# EAGLE schematic LTC4222 (EAGLE 9.6.2)
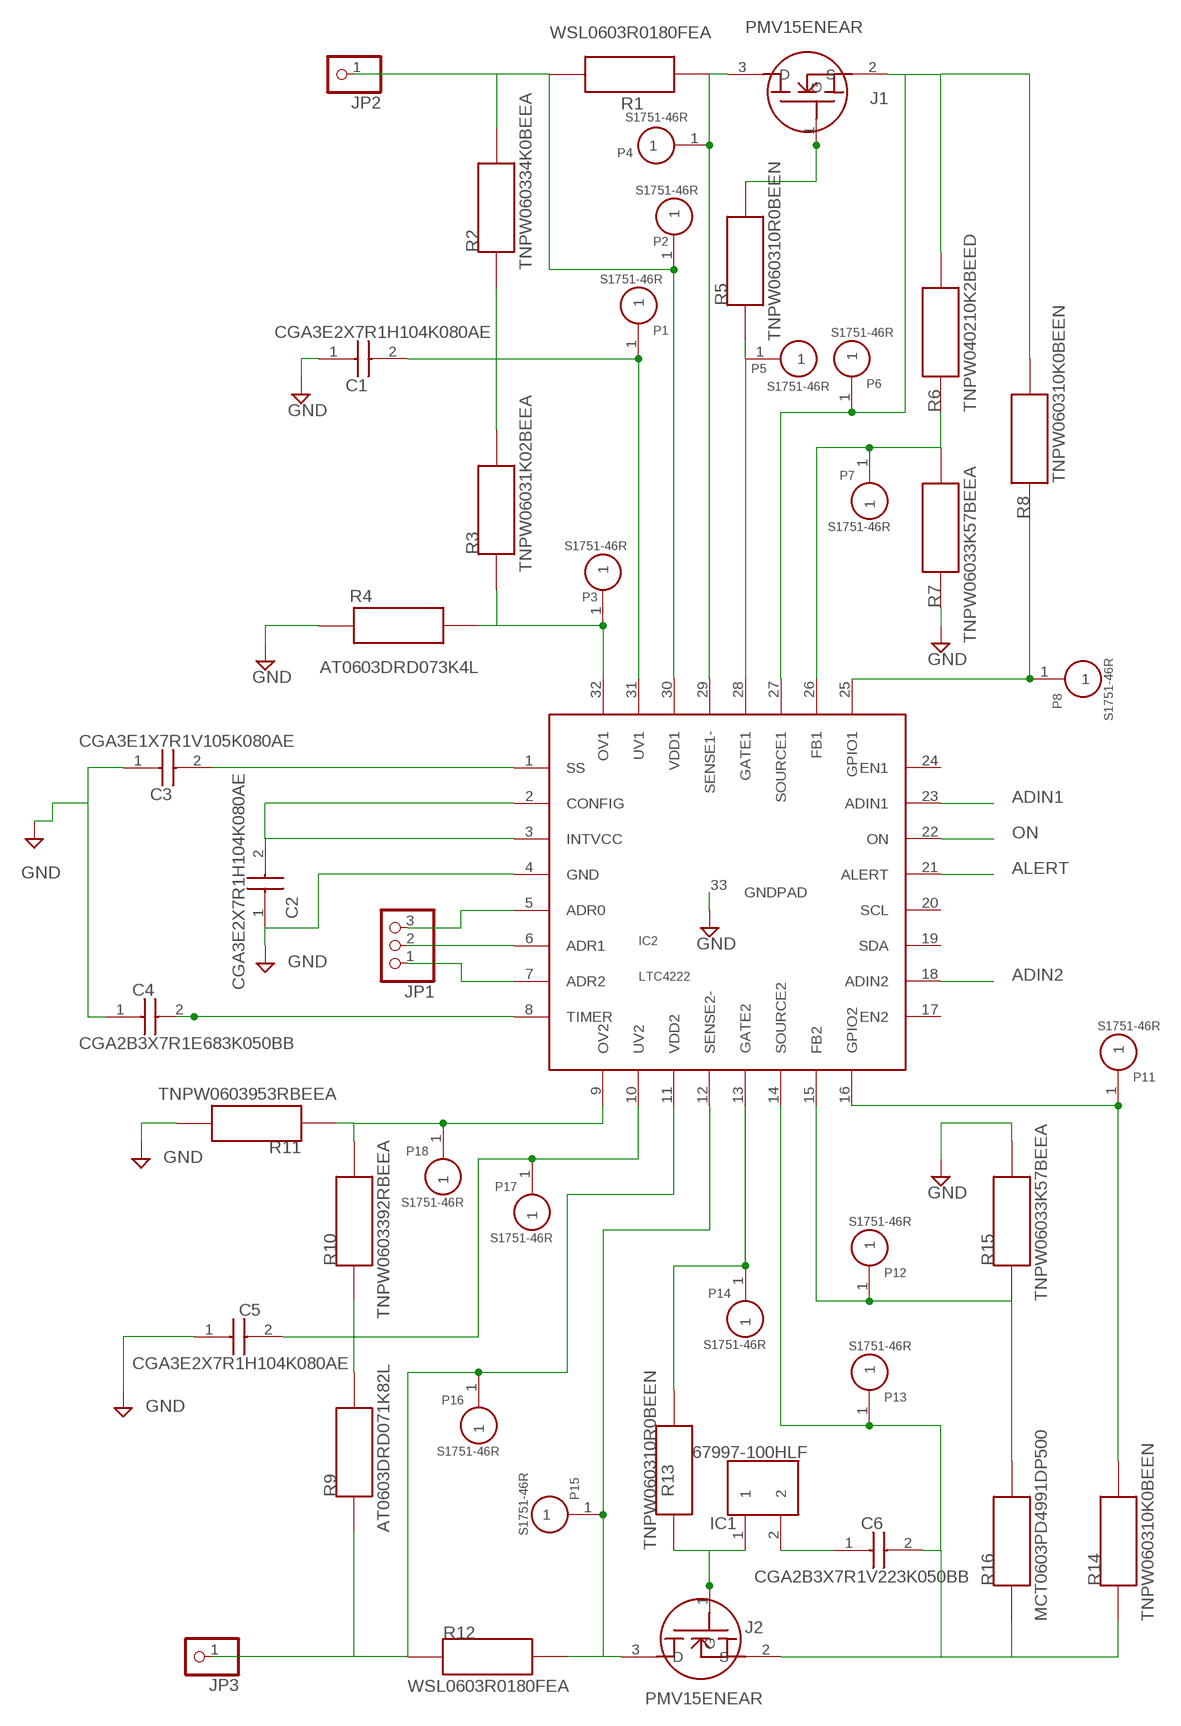
[diagram p0: schematic, sheet 1]

## Parts
C1  CGA3E2X7R1H104K080AE  [CAPC1608X80M]
C2  CGA3E2X7R1H104K080AE  [CAPC1608X80M]
C3  CGA3E1X7R1V105K080AE  [CAPC1608X80M]
C4  CGA2B3X7R1E683K050BB  [CAPC1005X50M]
C5  CGA3E2X7R1H104K080AE  [CAPC1608X80M]
C6  CGA2B3X7R1V223K050BB  [CAPC1005X50M]
IC1  67997-100HLF  [HDRV2W64P254_2X1_241X508X838B]
IC2  LTC4222  [QFN50P500X500X75-33T345M]
J1  PMV15ENEAR  [SOT95P230X110-3M]
J2  PMV15ENEAR  [SOT95P230X110-3M]
JP1  PINHD-1X3  [1X03]
JP2  PINHD-1X1  [1X01]
JP3  PINHD-1X1  [1X01]
P1  S1751-46R  [S1751-46R]
P2  S1751-46R  [S1751-46R]
P3  S1751-46R  [S1751-46R]
P4  S1751-46R  [S1751-46R]
P5  S1751-46R  [S1751-46R]
P6  S1751-46R  [S1751-46R]
P7  S1751-46R  [S1751-46R]
P8  S1751-46R  [S1751-46R]
P11  S1751-46R  [S1751-46R]
P12  S1751-46R  [S1751-46R]
P13  S1751-46R  [S1751-46R]
P14  S1751-46R  [S1751-46R]
P15  S1751-46R  [S1751-46R]
P16  S1751-46R  [S1751-46R]
P17  S1751-46R  [S1751-46R]
P18  S1751-46R  [S1751-46R]
R1  WSL0603R0180FEA  [RESC1507X40M]
R2  TNPW060334K0BEEA  [AT0603]
R3  TNPW06031K02BEEA  [AT0603]
R4  AT0603DRD073K4L  [RESC1608X45M]
R5  TNPW060310R0BEEN  [AT0603]
R6  TNPW040210K2BEED  [RESC1005X35M]
R7  TNPW06033K57BEEA  [AT0603]
R8  TNPW060310K0BEEN  [AT0603]
R9  AT0603DRD071K82L  [RESC1608X45M]
R10  TNPW0603392RBEEA  [AT0603]
R11  TNPW0603953RBEEA  [AT0603]
R12  WSL0603R0180FEA  [RESC1507X40M]
R13  TNPW060310R0BEEN  [AT0603]
R14  TNPW060310K0BEEN  [AT0603]
R15  TNPW06033K57BEEA  [AT0603]
R16  MCT0603PD4991DP500  [RESC1508X47M]

## Nets
ADIN1: IC2.23(ADIN1)
ADIN2: IC2.18(ADIN2)
ALERT: IC2.21(ALERT)
GND: C1.1 C2.1 C3.1 C4.1 C5.1 IC2.4(GND) R4.2 R7.1 R11.2 R15.2
N$1: J1.1(G) R5.2
N$2: IC2.30(VDD1) JP2.1 P2.1 R1.1 R2.2
N$6: IC2.29(SENSE1-) J1.3(D) P4.1 R1.2
N$7: IC2.32(OV1) P3.1 R3.1 R4.1
N$8: C1.2 IC2.31(UV1) P1.1 R2.1 R3.2
N$10: C2.2 IC2.2(CONFIG) IC2.3(INTVCC)
N$11: IC2.28(GATE1) P5.1 R5.1
N$12: IC2.27(SOURCE1) J1.2(S) P6.1 R6.2 R8.2
N$13: IC2.7(ADR2) JP1.1
N$14: IC2.25(GPIO1) P8.1 R8.1
N$15: C4.2 IC2.8(TIMER)
N$16: C3.2 IC2.1(SS)
N$18: IC2.13(GATE2) P14.1 R13.2
N$19: IC2.9(OV2) P18.1 R10.2 R11.1
N$20: IC2.12(SENSE2-) J2.3(D) P15.1 R12.2
N$21: IC2.11(VDD2) JP3.1 P16.1 R9.1 R12.1
N$22: IC1.1 J2.1(G) R13.1
N$23: C6.2 IC2.14(SOURCE2) J2.2(S) P13.1 R14.1 R16.1
N$24: C6.1 IC1.2
N$25: IC2.15(FB2) P12.1 R15.1 R16.2
N$26: IC2.16(GPIO2) P11.1 R14.2
N$27: C5.2 IC2.10(UV2) P17.1 R9.2 R10.1
N$29: IC2.26(FB1) P7.1 R6.1 R7.2
N$30: IC2.6(ADR1) JP1.2
N$31: IC2.5(ADR0) JP1.3
ON: IC2.22(ON)
Unconnected: IC2.17(EN2) IC2.19(SDA) IC2.20(SCL) IC2.24(EN1) IC2.33(GNDPAD)

## Library data of the parts
C1 C2 C5 = Baja_Parts_Lib:CGA3E2X7R1H104K080AE: Multilayer Ceramic Capacitors MLCC - SMD/SMT SOFT 0603 50V 0.1uF X7R 10% AEC-Q200 Source: Data Sheet <https://product.tdk.com/system/files/dam/doc/product/capacitor/ceramic/mlcc/catalog/mlcc_automotive_soft_en.pdf>; DESCRIPTION: Multilayer Ceramic Capacitors MLCC - SMD/SMT SOFT 0603 50V 0.1uF X7R 10% AEC-Q200; HEIGHT: 0.8 mm; MANUFACTURER_NAME: TDK; MANUFACTURER_PART_NUMBER: CGA3E2X7R1H104K080AE; MOUSER_PART_NUMBER: 810-CGA3E2X7R1H104KE; MOUSER_PRICE-STOCK: https://www.mouser.com/ProductDetail/TDK/CGA3E2X7R1H104K080AE?qs=n%2FVzw7c4a0kvajqFvEbDzQ%3D%3D
C3 = Baja_Parts_Lib:CGA3E1X7R1V105K080AE: Multilayer Ceramic Capacitors MLCC - SMD/SMT SOFT 0603 35V 1uF X7R 10% AEC-Q200 Source: Data Sheet <https://product.tdk.com/system/files/dam/doc/product/capacitor/ceramic/mlcc/catalog/mlcc_automotive_soft_en.pdf>; DESCRIPTION: Multilayer Ceramic Capacitors MLCC - SMD/SMT SOFT 0603 35V 1uF X7R 10% AEC-Q200; HEIGHT: 0.8 mm; MANUFACTURER_NAME: TDK; MANUFACTURER_PART_NUMBER: CGA3E1X7R1V105K080AE; MOUSER_PART_NUMBER: 810-CGA3E1X7R1V105KA; MOUSER_PRICE-STOCK: https://www.mouser.com/ProductDetail/TDK/CGA3E1X7R1V105K080AE?qs=nQSIdc08i%252BfiPojSMYifNA%3D%3D
C4 = Baja_Parts_Lib:CGA2B3X7R1E683K050BB: Multilayer Ceramic Capacitors MLCC - SMD/SMT CGA 0402 25V 0.068uF X7R 10% AEC-Q200 Source: Data Sheet <https://product.tdk.com/system/files/dam/doc/product/capacitor/ceramic/mlcc/catalog/mlcc_automotive_general_en.pdf>; DESCRIPTION: Multilayer Ceramic Capacitors MLCC - SMD/SMT CGA 0402 25V 0.068uF X7R 10% AEC-Q200; HEIGHT: 0.5 mm; MANUFACTURER_NAME: TDK; MANUFACTURER_PART_NUMBER: CGA2B3X7R1E683K050BB; MOUSER_PART_NUMBER: 810-CGA2B3X7R1E683KB; MOUSER_PRICE-STOCK: https://www.mouser.com/ProductDetail/TDK/CGA2B3X7R1E683K050BB?qs=xLDY6iXSiQadJRj3xSTsHw%3D%3D
C6 = Baja_Parts_Lib:CGA2B3X7R1V223K050BB: Multilayer Ceramic Capacitors MLCC - SMD/SMT CGA 0402 35V 0.022uF X7R 10% AEC-Q200 Source: Data Sheet <https://product.tdk.com/system/files/dam/doc/product/capacitor/ceramic/mlcc/catalog/mlcc_automotive_general_en.pdf>; DESCRIPTION: Multilayer Ceramic Capacitors MLCC - SMD/SMT CGA 0402 35V 0.022uF X7R 10% AEC-Q200; HEIGHT: 0.5 mm; MANUFACTURER_NAME: TDK; MANUFACTURER_PART_NUMBER: CGA2B3X7R1V223K050BB; MOUSER_PART_NUMBER: 810-CGA2B3X7R1V223KB; MOUSER_PRICE-STOCK: https://www.mouser.com/ProductDetail/TDK/CGA2B3X7R1V223K050BB?qs=xLDY6iXSiQZvE13Mgd36Mg%3D%3D
IC1 = Baja_Parts_Lib:67997-100HLF: Headers & Wire Housings .100CC STR HEADER Source: Data Sheet <https://www.mouser.com/datasheet/2/18/1/bwb_bergstik-2578275.pdfhttps://www.mouser.com/datasheet/2/18/1/bwb_bergstik-2578275.pdf>; DESCRIPTION: Headers & Wire Housings .100CC STR HEADER; HEIGHT: 31.04 mm; MANUFACTURER_NAME: Amphenol FCi; MANUFACTURE_PART_NUMBER: 67997-100HLF; MOUSER_PART_NUMBER: 649-67997-100HLF; MOUSER_PRICE-STOCK: https://www.mouser.com/ProductDetail/Amphenol-FCI/67997-100HLF?qs=cpLrBgdhsoH33Mp6xh%2FbyQ%3D%3D
IC2 = Baja_Parts_Lib:LTC4222: Hot Swap Voltage Controllers Dual Hot Swap Controller w/ADC and I2C Source: Data Sheet <https://www.mouser.com/datasheet/2/609/4222fb-1270163.pdf>; DESCRIPTION: Hot Swap Voltage Controllers Dual Hot Swap Controller w/ADC and I2C; HEIGHT: 0.75 mm; MANUFACTURER_NAME: Analog Devices; MANUFACTURER_PART_NUMBER: LTC4222CUH#PBF; MOUSER_PART_NUMBER: 584-LTC4222CUH#PBF; MOUSER_PRICE-STOCK: https://www.mouser.com/ProductDetail/Analog-Devices/LTC4222CUHPBF?qs=sGAEpiMZZMsKEdP9slC0YZc6cH0Tuf0NcujsStLpH6A%3D
J1 J2 = Baja_Parts_Lib:PMV15ENEAR: MOSFET 30V N-CHANNEL Source: Data Sheet <https://www.mouser.com/datasheet/2/916/PMV15ENEA-1604828.pdf>; DESCRIPTION: MOSFET 30V N-CHANNEL; HEIGHT: 1 mm; MANUFACTURER_NAME: Nexperia; MANUFACTURER_PART_NUMBER: PMV15ENEAR; MOUSER_PART_NUMBER: 771-PMV15ENEAR; MOUSER_PRICE-STOCK: https://www.mouser.com/ProductDetail/Nexperia/PMV15ENEAR?qs=T3oQrply3y80fkWq77yzJw%3D%3D
JP1 = pinhead:PINHD-1X3: PIN HEADER
JP2 JP3 = pinhead:PINHD-1X1: PIN HEADER
P1-P8 P11-P18 = Baja_Parts_Lib:S1751-46R
R1 R12 = Baja_Parts_Lib:WSL0603R0180FEA: Current Sense Resistors - SMD 1/10watt .018ohms 1% Source: Data Sheet <https://www.mouser.com/datasheet/2/427/VISH_S_A0011931981_1-2572395.pdf>; DESCRIPTION: Current Sense Resistors - SMD 1/10watt .018ohms 1%; HEIGHT: 0.33 mm; MANUFACTURER_NAME: Vishay/Dale; MANUFACTURER_PART_NUMBER: WSL0603R0180FEA; MOUSER_PART_NUMBER: 71-WSL0603R0180FEA; MOUSER_PRICE-STOCK: https://www.mouser.com/ProductDetail/Vishay-Dale/WSL0603R0180FEA?qs=WgxguIJepIVxM5lrrv8PKQ%3D%3D
R2 = Baja_Parts_Lib:TNPW060334K0BEEA: Thin Film Resistors - SMD 34Kohms .1% 25ppm Source: Data Sheet <https://www.mouser.com/datasheet/2/427/tnpw_e3-1761965.pdf>; DESCRIPTION: Thin Film Resistors - SMD 34Kohms .1% 25ppm; HEIGHT: 0.45 mm; MANUFACTURER_NAME: Vishay/Dale; MANUFACTURER_PART_NUMBER: TNPW060334K0BEEA; MOUSER_PART_NUMBER: 71-TNPW060334K0BEEA; MOUSER_PRICE-STOCK: https://www.mouser.com/ProductDetail/Vishay-Dale/TNPW060334K0BEEA?qs=kHCK1FE53PlE3u8PggA5Ww%3D%3D
R3 = Baja_Parts_Lib:TNPW06031K02BEEA: Thin Film Resistors - SMD 1.02Kohms .1% 25ppm Source: Data Sheet <https://www.mouser.com/datasheet/2/427/tnpw_e3-1761965.pdf>; DESCRIPTION: Thin Film Resistors - SMD 1.02Kohms .1% 25ppm; HEIGHT: 0.45 mm; MANUFACTURER_NAME: Vishay/Dale; MANUFACTURER_PART_NUMBER: TNPW06031K02BEEA; MOUSER_PART_NUMBER: 71-TNPW06031K02BEEA; MOUSER_PRICE-STOCK: https://www.mouser.com/ProductDetail/Vishay-Dale/TNPW06031K02BEEA?qs=U8jWr0D8IJjr1FstIpZwmw%3D%3D
R4 = Baja_Parts_Lib:AT0603DRD073K4L: Thin Film Resistors - SMD 3.4 Kohms 0.5% Tol. AEC-Q200 Source: Data Sheet <https://www.mouser.com/datasheet/2/447/PYu_AT_51_RoHS_L_5-1714247.pdf>; DESCRIPTION: Thin Film Resistors - SMD 3.4 Kohms 0.5% Tol. AEC-Q200; HEIGHT: 0.45 mm; MANUFACTURER_PART_NUMBER: AT0603DRD073K4L; MANUFACTURE_NAME: YAGEO; MOUSER_PART_NUMBER: 603-AT0603DRD073K4L; MOUSER_PRICE-STOCK: https://www.mouser.com/ProductDetail/YAGEO/AT0603DRD073K4L?qs=tggtontpCXPtTFYMCVhXyg%3D%3D
R5 R13 = Baja_Parts_Lib:TNPW060310R0BEEN: Thin Film Resistors - SMD 10ohms .1% 25ppm Source: Data Sheet <https://www.mouser.com/datasheet/2/427/tnpw_e3-1761965.pdf>; DESCRIPTION: Thin Film Resistors - SMD 10ohms .1% 25ppm; HEIGHT: 0.45 mm; MANUFACTURER_NAME: Vishay/Dale; MANUFACTURER_PART_NUMBER: TNPW060310R0BEEN; MOUSER_PART_NUMBER: 71-TNPW060310R0BEEN; MOUSER_PRICE-STOCK: https://www.mouser.com/ProductDetail/Vishay-Dale/TNPW060310R0BEEN?qs=sGAEpiMZZMtlubZbdhIBINBUesVvBWI8Ir7KK%252BezhzA%3D
R6 = Baja_Parts_Lib:TNPW040210K2BEED: Thin Film Resistors - SMD 10.2Kohms .1% 25ppm Source: Data Sheet <https://www.mouser.com/datasheet/2/427/tnpw_e3-1761965.pdf>; DESCRIPTION: Thin Film Resistors - SMD 10.2Kohms .1% 25ppm; HEIGHT: 0.35 mm; MANUFACTURER_NAME: Vishay/Dale; MANUFACTURER_PART_NUMBER: TNPW040210K2BEED; MOUSER_PART_NUMBER: 71-TNPW040210K2BEED; MOUSER_PRICE-STOCK: https://www.mouser.com/ProductDetail/Vishay-Dale/TNPW040210K2BEED?qs=sGAEpiMZZMtlubZbdhIBIPq2G7T3A9VRhqKxiHUGEIk%3D
R7 R15 = Baja_Parts_Lib:TNPW06033K57BEEA: Thin Film Resistors - SMD 3.57kohms .1% 25ppm Source: Data Sheet <https://www.mouser.com/datasheet/2/427/tnpw_e3-1761965.pdf>; DESCRIPTION: Thin Film Resistors - SMD 3.57kohms .1% 25ppm; HEIGHT: 0.45 mm; MANUFACTURER_NAME: Vishay/Dale; MANUFACTURER_PART_NUMBER: TNPW06033K57BEEA; MOUSER_PART_NUMBER: 71-TNPW06033K57BEEA; MOUSER_PRICE-STOCK: https://www.mouser.com/ProductDetail/Vishay-Dale/TNPW06033K57BEEA?qs=kHCK1FE53Pku%252BV6IyV8rEg%3D%3D
R8 R14 = Baja_Parts_Lib:TNPW060310K0BEEN: Thin Film Resistors - SMD 10Kohms .1% 25ppm Source: Data Sheet <https://www.mouser.com/datasheet/2/427/tnpw_e3-1761965.pdf>; DESCRIPTION: Thin Film Resistors - SMD 10Kohms .1% 25ppm; HEIGHT: 0.45 mm; MANUFACTURER_NAME: Vishay/Dale; MANUFACTURER_PART_NUMBER: TNPW060310K0BEEN; MOUSER_PART_NUMBER: 71-TNPW060310K0BEEN; MOUSER_PRICE-STOCK: https://www.mouser.com/ProductDetail/Vishay-Dale/TNPW060310K0BEEN?qs=ys0FHdAnsy4pY5DJwuessg%3D%3D
R9 = Baja_Parts_Lib:AT0603DRD071K82L: Thin Film Resistors - SMD 1.82 Kohms 0.5% Tol. AEC-Q200 Source: Data Sheet <https://www.mouser.com/datasheet/2/447/PYu_AT_51_RoHS_L_5-1714247.pdf>; DESCRIPTION: Thin Film Resistors - SMD 1.82 Kohms 0.5% Tol. AEC-Q200; HEIGHT: 0.45 mm; MANUFACTURER_NAME: YAGEO; MANUFACTURER_PART_NUMBER: AT0603DRD071K82L; MOUSER_PART_NUMBER: 603-AT0603DRD071K82L; MOUSER_PRICE-STOCK: https://www.mouser.com/ProductDetail/Yageo/AT0603DRD071K82L?qs=tggtontpCXPbCWwxdLaIvQ%3D%3D
R10 = Baja_Parts_Lib:TNPW0603392RBEEA: Thin Film Resistors - SMD 392ohms .1% 25ppm Source: Data Sheet <https://www.mouser.com/datasheet/2/427/tnpw_e3-1761965.pdf>; DESCRIPTION: Thin Film Resistors - SMD 392ohms .1% 25ppm; HEIGHT: 0.45 mm; MANUFACTURER_NAME: Vishay/Dale; MANUFACTURER_PART_NUMBER: TNPW0603392RBEEA; MOUSER_PART_NUMBER: 71-TNPW0603392RBEEA; MOUSER_PRICE-STOCK: https://www.mouser.com/ProductDetail/Vishay-Dale/TNPW0603392RBEEA?qs=kHCK1FE53PkNbYaq0EU6Lw%3D%3D
R11 = Baja_Parts_Lib:TNPW0603953RBEEA: Thin Film Resistors - SMD 953ohms .1% 25ppm Source: Data Sheet <https://www.mouser.com/datasheet/2/427/tnpw_e3-1761965.pdf>; DESCRIPTION: Thin Film Resistors - SMD 953ohms .1% 25ppm; HEIGHT: 0.45 mm; MANUFACTURER_NAME: Vishay/Dale; MANUFACTURER_PART_NUMBER: TNPW0603953RBEEA; MOUSER_PART_NUMBER: 71-TNPW0603953RBEEA; MOUSER_PRICE-STOCK: https://www.mouser.com/ProductDetail/Vishay-Dale/TNPW0603953RBEEA?qs=CqEPuS5aiX8a1bzjUmak3Q%3D%3D
R16 = Baja_Parts_Lib:MCT0603PD4991DP500: Thin Film Resistors - SMD .250W 4.99Kohms .5% 0603 25ppm Hi Power Source: Data Sheet <https://www.mouser.com/datasheet/2/427/VISH_S_A0003695214_1-2569092.pdf>; DESCRIPTION: Thin Film Resistors - SMD .250W 4.99Kohms .5% 0603 25ppm Hi Power; HEIGHT: 0.45 mm; MANUFACTURER_NAME: Vishay/Beyschlag; MANUFACTURER_PART_NUMBER: MCT0603PD4991DP500; MOUSER_PART_NUMBER: 594-MCT0603PD4991DP5; MOUSER_PRICE-STOCK: https://www.mouser.com/ProductDetail/Vishay-Beyschlag/MCT0603PD4991DP500?qs=5aG0NVq1C4xQ68f1sPHBvQ%3D%3D